# EasyEDA Pro project ProPrj_arm_can_tool_2026-04-18.epro, board PCB1
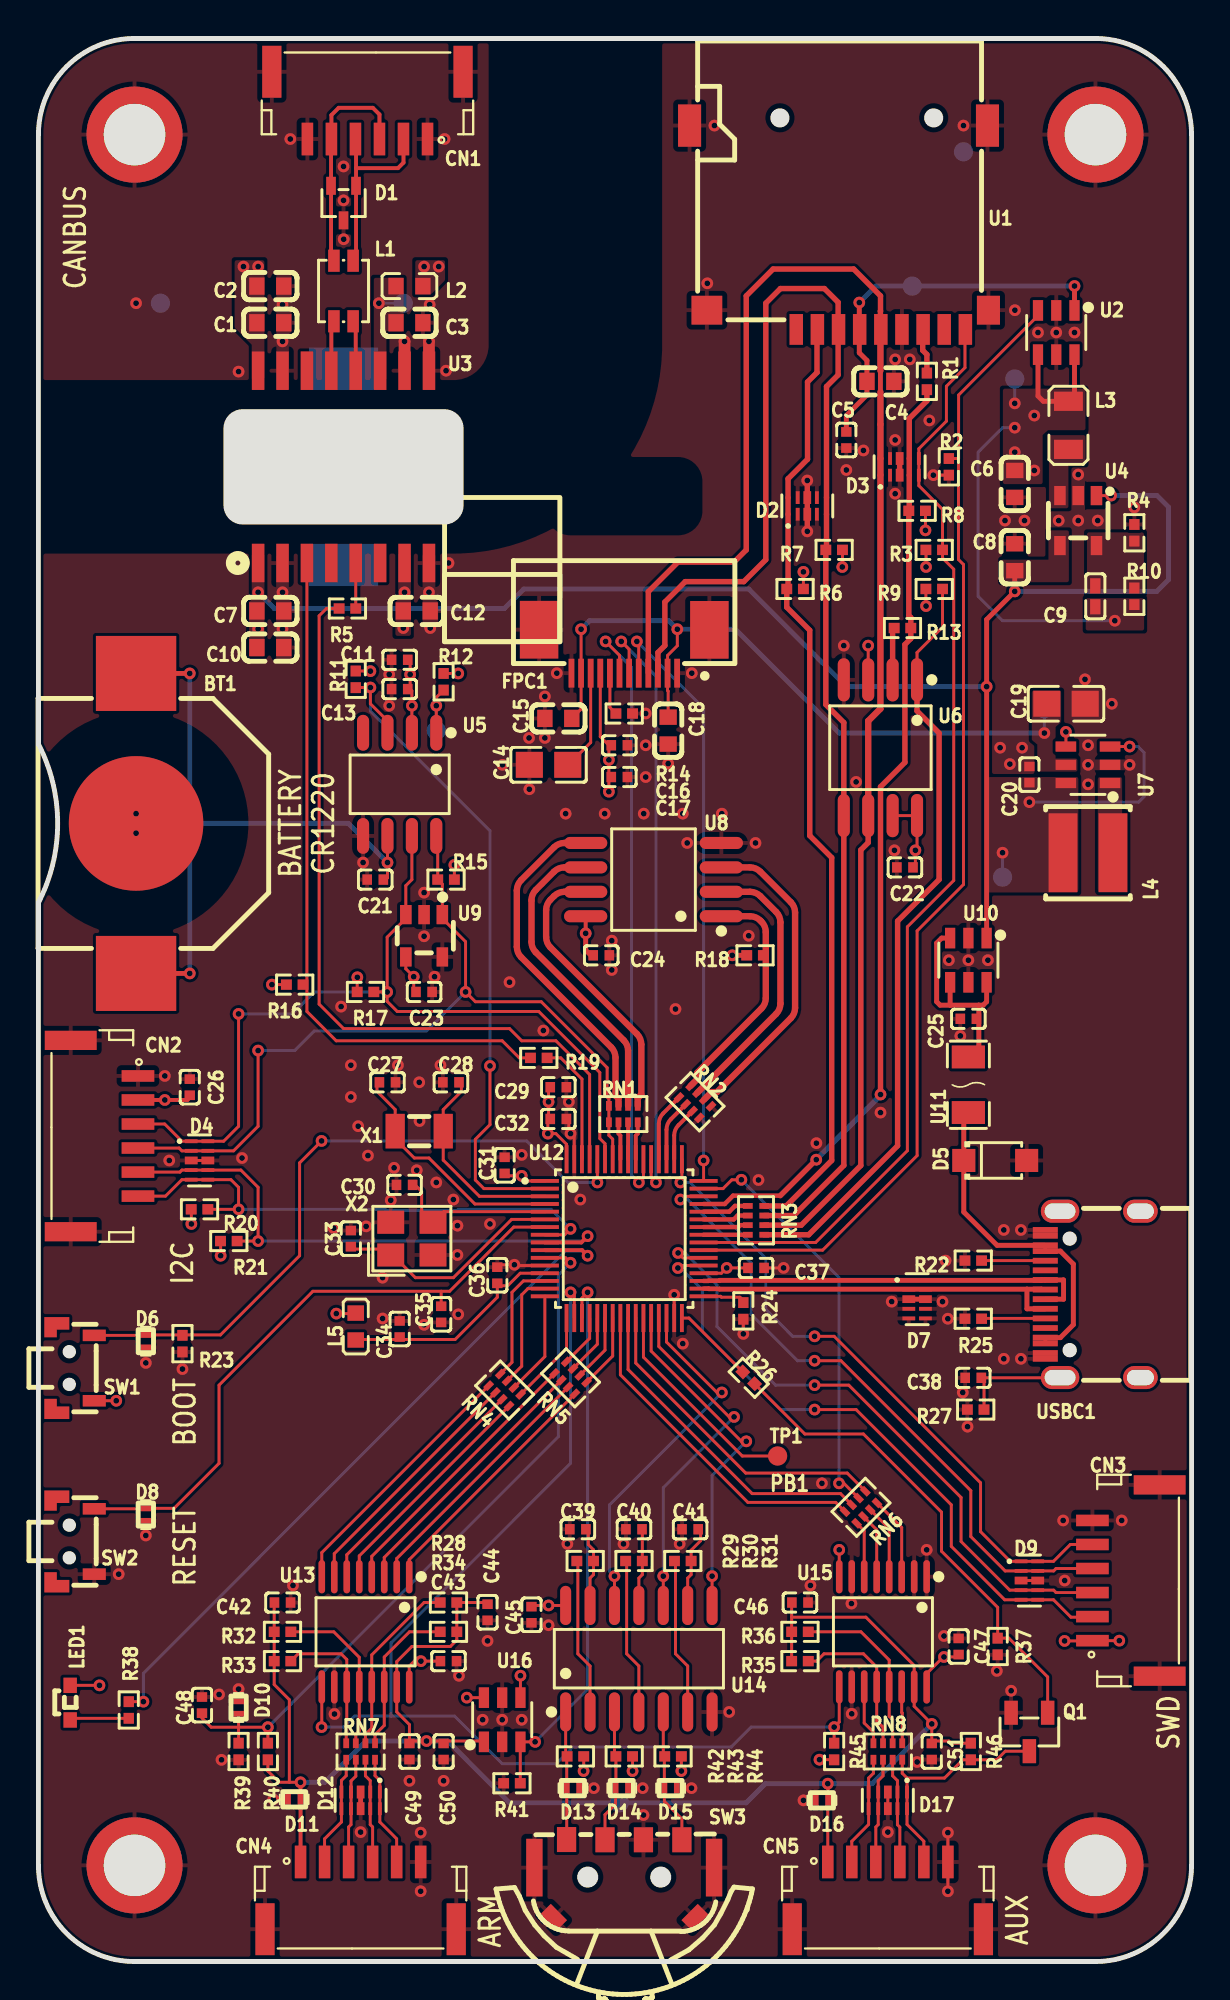
[diagram p3: board, top side]
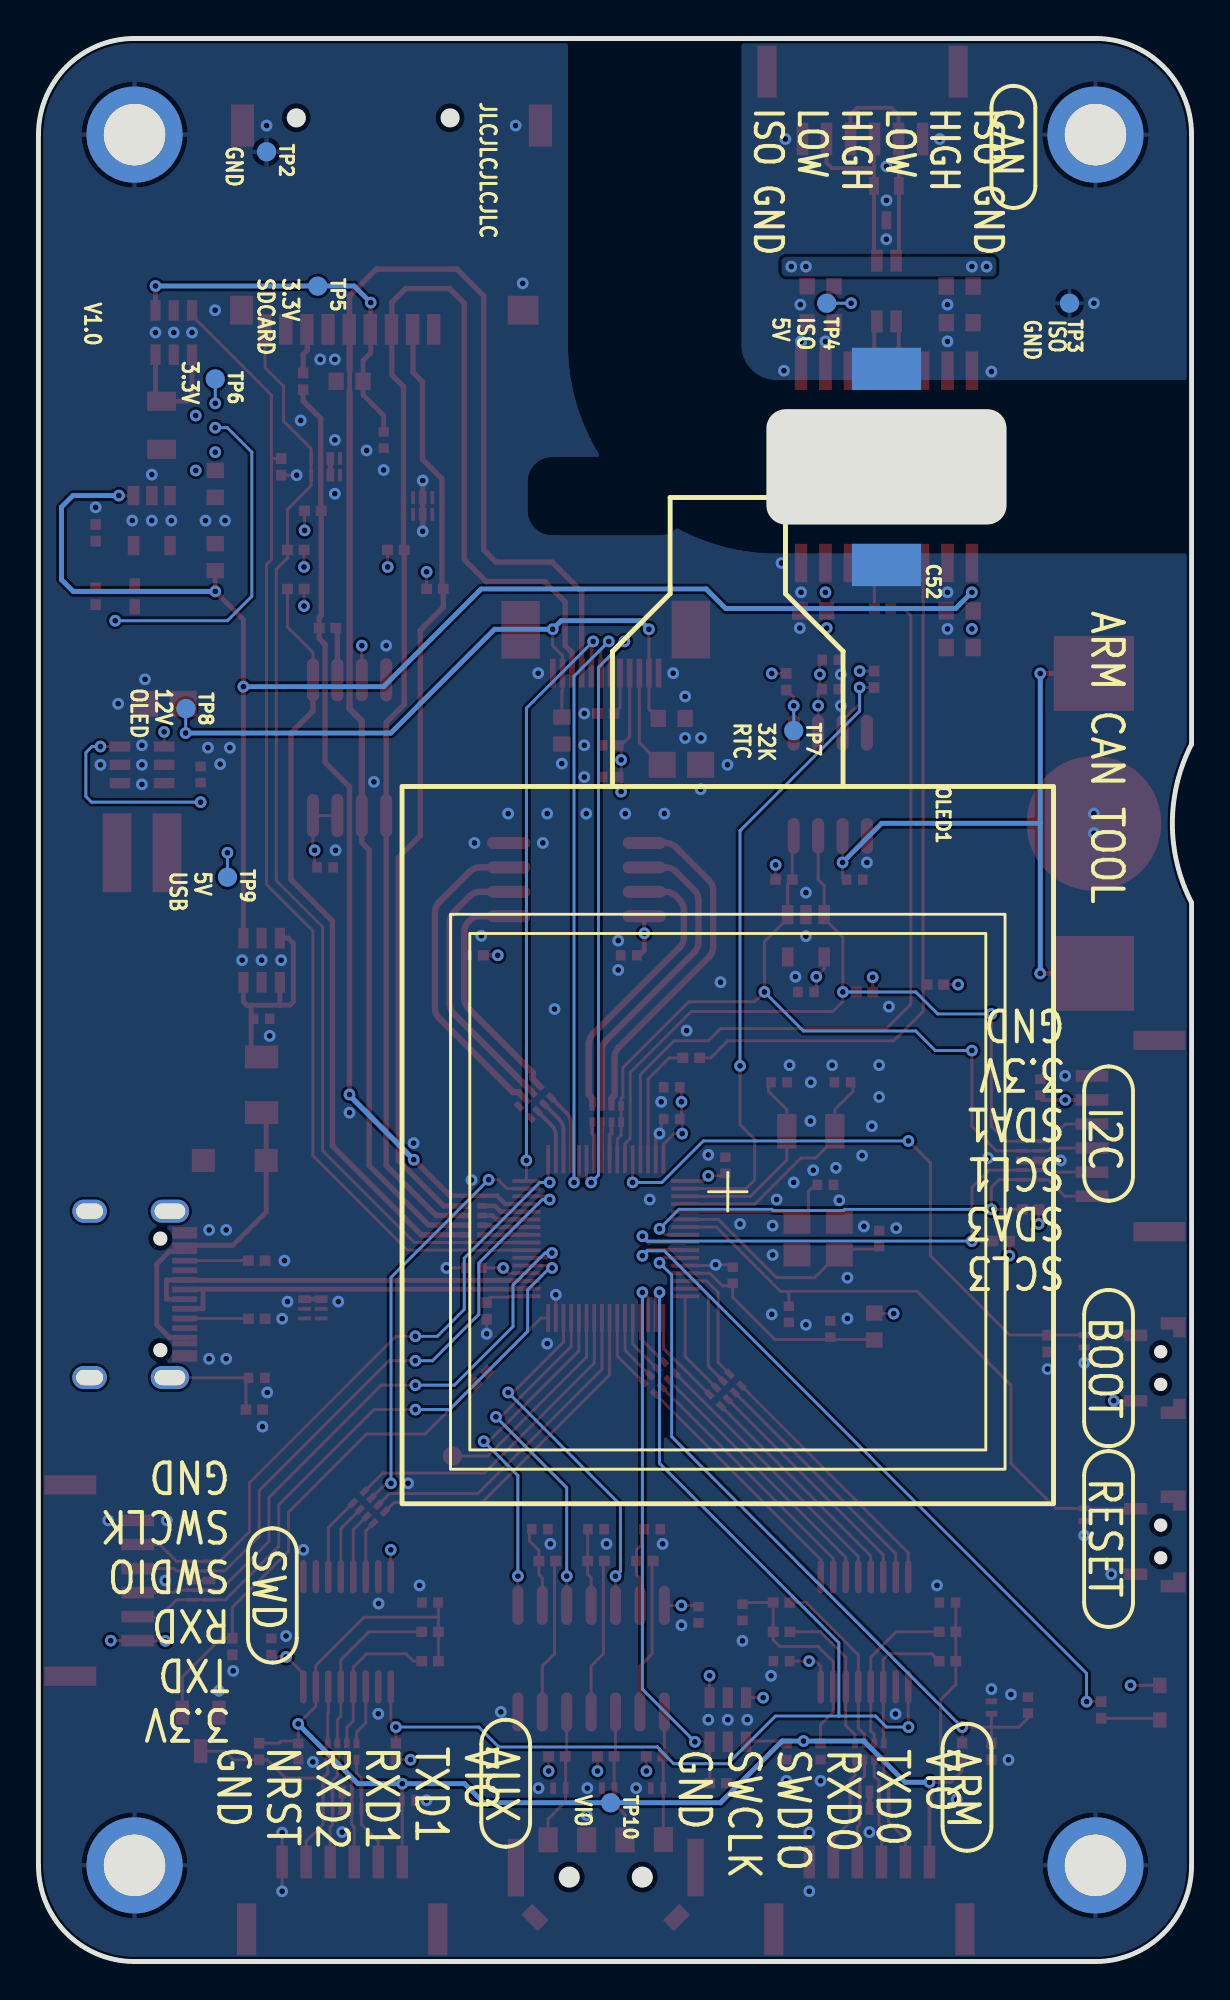
[diagram p4: board, bottom side, seen from below]

Outline 60 x 100 mm; copper layers: Top Layer, Inner1, Inner2, Bottom Layer. Coordinates in mm from the lower left corner of the outline.
Outline path: 0,95 arc(1.46,98.54) 5,100 55,100 arc(58.54,98.54) 60,95 60,5 arc(58.54,1.46) 55,0 5,0 arc(1.46,1.46) 0,5 0,55.06 arc(1,59.18) 0,63.3 0,95
Stack: Top Layer 0.035mm 外层铜厚1oz / Dielectric1 0.2104mm 7628 RC49% 8.6mil / Inner1 0.0152mm 内层铜厚 / Dielectric2 1.065mm 1.1mm H/HOZ 含铜 / Inner2 0.0152mm 内层铜厚 / Dielectric3 0.2104mm 7628 RC49% 8.6mil / Bottom Layer 0.035mm 外层铜厚1oz

## Design rules (mm)
net HS_DP: DP1
net HS_DM: DP1
template: Custom Config
spacing copperThickness1oz (default): track to track 0.102, other pairs 0.152 to 0.3
spacing copperThickness2oz: track to track 0.203, other pairs 0.152 to 0.3
track width copperThickness1oz (default): min 0.127, default 0.254, max 2.54
track width copperThickness2oz: min 0.203, default 0.254, max 2.54
track width power: min 0.152, default 0.203, max 2.54
differential pair differentialPair (default): width min 0.127, default 0.254, max 2.54; gap min 0.152, default 0.203
via viaSize (default): diameter min 0.5, default 0.61, max 10; hole min 0.3, default 0.305, max 6.299
['net', 'can gnd'] ['NET', '3.3V'] uses copper_CAN_GND
['net', 'can gnd'] ['NET', 'GND'] uses copper_CAN_GND
pour e771 uses copper_direct
pour e16 uses copper_direct
pour e42 uses copper_direct
pour e439 uses copper_direct
pour e204 uses copper_direct
pour e2702 uses copper_direct
pour e3149 uses copper_direct
pour e8360 uses copper_direct
pour e1013 uses copper_direct
pour e2974 uses copper_direct
pour e4745 uses copper_direct
pour e7080 uses copper_direct
pour e9255 uses copper_direct
pour e10368 uses copper_direct
pour e11440 uses copper_direct
pour e15142 uses copper_direct
pour e9206 uses copper_direct
pour e146 uses copper_direct
pour e158 uses copper_direct

## Placement (name value [footprint] x y rotation side)
BT1  MY-1220-03  [BAT-SMD_MY-1220-03]  5.08 59.18 90 top
C1  100nF  [C0603]  12.06 85.22 180 top
C2  10uF  [C0603]  12.06 87.12 180 top
C3  1uF  [C0603]  19.3 85.22 180 top
C4  4.7uF  [C0603]  43.81 82.17 180 top
C5  100nF  [C0402#2]  42.04 79.12 270 top
C6  22uF  [C0603]  50.8 76.83 90 top
C7  100nF  [C0603]  12.06 70.23 180 top
C8  4.7uF  [C0603]  50.8 73.02 270 top
C9  22pF  [C0402]  54.99 70.99 270 top
C10  10uF  [C0603]  12.06 68.33 180 top
C11  1uF  [C0402#2]  18.8 67.69 0 top
C12  1uF  [C0603]  19.69 70.23 180 top
C13  100nF  [C0402#2]  18.8 66.17 0 top
C14  2.2uF  [C0805]  26.54 62.23 0 top
C15  100nF  [C0603]  27.05 64.64 0 top
C16  100nF  [C0402#2]  30.23 63.25 180 top
C17  4.7uF  [C0402#2]  30.23 61.59 180 top
C18  100nF  [C0603]  32.77 64.01 90 top
C19  10uF  [C0805]  53.47 65.4 180 top
C20  4.7uF  [C0402#2]  51.56 61.72 270 top
C21  1uF  [C0402#2]  17.53 56.26 0 top
C22  100nF  [C0402#2]  45.09 56.9 180 top
C23  100nF  [C0402#2]  20.07 50.42 180 top
C24  100nF  [C0402#2]  29.29 52.32 0 top
C25  1uF  [C0402#2]  48.39 49.02 0 top
C26  1uF  [C0402#2]  7.87 45.47 270 top
C27  18pF  [C0402#2]  18.16 45.72 180 top
C28  18pF  [C0402#2]  21.46 45.72 0 top
C29  4.7uF  [C0402#2]  27.05 45.47 180 top
C30  15pF  [C0402#2]  19.05 40.39 180 top
C31  100nF  [C0402#2]  24.26 41.4 270 top
C32  100nF  [C0402#2]  27.05 43.81 180 top
C33  15pF  [C0402#2]  16.26 37.59 270 top
C34  1uF  [C0402#2]  18.8 32.89 270 top
C35  100nF  [C0402#2]  20.96 33.65 90 top
C36  100nF  [C0402#2]  23.88 35.69 270 top
C37  100nF  [C0402#2]  37.34 36.07 180 top
C38  4.7nF  [C0402#2]  48.64 30.35 0 top
C39  1uF  [C0402#2]  28.07 22.48 180 top
C40  1uF  [C0402#2]  30.99 22.48 180 top
C41  1uF  [C0402#2]  33.91 22.48 180 top
C42  100nF  [C0402#2]  12.7 18.67 0 top
C43  100nF  [C0402#2]  21.34 15.62 0 top
C44  100nF  [C0402#2]  23.37 18.16 270 top
C45  100nF  [C0402#2]  25.65 18.03 90 top
C46  100nF  [C0402#2]  39.62 18.67 0 top
C47  100nF  [C0402#2]  47.88 16.38 90 top
C48  100nF  [C0402#2]  8.51 13.33 90 top
C49  1uF  [C0402#2]  19.3 10.92 90 top
C50  100nF  [C0402#2]  21.08 10.92 270 top
C51  100nF  [C0402#2]  46.48 10.92 270 top
C52  2.2nF  [CAP-SMD_L7.8-W5.4-P9.60_TMY1222M]  15.88 77.72 90 bottom
CN1  SM06B-GHS-TB(LF)(SN)  [CONN-TH_SM06B-GHS-TB-LF-SN]  17.12 96.52 180 top
CN2  SM06B-GHS-TB(LF)(SN)  [CONN-TH_SM06B-GHS-TB-LF-SN]  3.43 42.93 270 top
CN3  SM06B-GHS-TB(LF)(SN)  [CONN-TH_SM06B-GHS-TB-LF-SN]  56.59 19.81 90 top
CN4  SM06B-GHS-TB(LF)(SN)  [CONN-TH_SM06B-GHS-TB-LF-SN]  16.76 3.43 0 top
CN5  SM06B-GHS-TB(LF)(SN)  [CONN-TH_SM06B-GHS-TB-LF-SN]  44.2 3.43 0 top
D1  ESDCAN03-2BWY  [SOT-323-3_L2.0-W1.3-P1.30-LS2.1-BR]  15.88 91.44 90 top
D2  H5VU25U  [DFN2510-10_L2.5-W1.0-P0.50-BL]  40 75.69 0 top
D3  H5VU25U  [DFN2510-10_L2.5-W1.0-P0.50-BL]  44.81 77.72 0 top
D4  H5VU25U  [DFN2510-10_L2.5-W1.0-P0.50-BL]  8.38 41.66 270 top
D5  SMF5.0A  [SOD-123FL_L2.7-W1.8-LS3.8-RD]  49.78 41.66 0 top
D6  H5VL10B  [SOD-882_L1.0-W0.6-BI]  5.59 32.26 90 top
D7  H5VU25U  [DFN2510-10_L2.5-W1.0-P0.50-BL]  45.72 34.44 270 top
D8  H5VL10B  [SOD-882_L1.0-W0.6-BI]  5.59 23.24 90 top
D9  H5VU25U  [DFN2510-10_L2.5-W1.0-P0.50-BL]  51.56 19.81 270 top
D10  H5VL10B  [SOD-882_L1.0-W0.6-BI]  10.41 13.21 270 top
D11  H5VL10B  [SOD-882_L1.0-W0.6-BI]  13.31 8.43 0 top
D12  H5VU25U  [DFN2510-10_L2.5-W1.0-P0.50-BL]  16.76 8.38 180 top
D13  H5VL10B  [SOD-882_L1.0-W0.6-BI]  27.81 9.02 180 top
D14  H5VL10B  [SOD-882_L1.0-W0.6-BI]  30.35 9.02 180 top
D15  H5VL10B  [SOD-882_L1.0-W0.6-BI]  32.89 9.02 180 top
D16  H5VL10B  [SOD-882_L1.0-W0.6-BI]  40.77 8.38 0 top
D17  H5VU25U  [DFN2510-10_L2.5-W1.0-P0.50-BL]  44.2 8.38 180 top
FPC1  AFC07-S12ECA-00  [FPC-SMD_12P-P0.50_AFC07-S12ECA-00]  30.48 68.12 180 top
L1  ACT1210-510-2P-TL00  [FILTER-SMD_4P-L3.2-W2.5-BL_ACT1210]  15.88 86.87 0 top
L2  GZ1608D601TF  [L0603]  19.3 87.12 180 top
L3  1uH  [IND-SMD_L2.5-W2.0-A]  53.59 79.88 90 top
L4  10uH  [IND-SMD_L4.1-W4.1_FTC404020S]  54.61 57.66 0 top
L5  10uH  [L0603]  16.51 33.02 270 top
LED1  LTST-S270KGKT  [LED-SMD_L1.7-W0.6-RD]  1.65 13.46 90 top
M1  Mech_Hole_3.2mm  [MECH_HOLE_3.2MM]  5 95 0 top
M2  Mech_Hole_3.2mm  [MECH_HOLE_3.2MM]  55 95 0 top
M3  Mech_Hole_3.2mm  [MECH_HOLE_3.2MM]  5 5 0 top
M4  Mech_Hole_3.2mm  [MECH_HOLE_3.2MM]  55 5 0 top
OLED1  ZJY150-2828KSWKG03  [OLED-ZJY150-2828KSWKG03]  30.48 40.03 0 bottom
Q1  AO3400A  [SOT-23-3_L2.9-W1.3-P1.90-LS2.4-BR]  51.56 11.94 90 top
R1  33Ω  [R0402]  46.23 82.17 90 top
R2  47kΩ  [R0402]  47.37 77.72 90 top
R3  47kΩ  [R0402]  46.61 73.41 180 top
R4  33kΩ  [R0402]  57.02 74.29 270 top
R5  33Ω  [R0402]  16.08 70.36 0 top
R6  47kΩ  [R0402]  39.37 71.37 0 top
R7  47kΩ  [R0402]  41.4 73.41 0 top
R8  47kΩ  [R0402]  45.72 75.44 0 top
R9  10kΩ  [R0402]  46.61 71.37 0 top
R10  150kΩ  [R0402]  57.02 70.99 270 top
R11  10kΩ  [R0402]  16.51 66.67 90 top
R12  10kΩ  [R0402]  21.08 66.55 90 top
R13  33Ω  [R0402]  44.96 69.34 180 top
R14  910kΩ  [R0402]  30.48 64.9 180 top
R15  4.7kΩ  [R0402]  21.21 56.26 180 top
R16  10kΩ  [R0402]  13.34 50.8 180 top
R17  4.7kΩ  [R0402]  17.02 50.42 0 top
R18  10kΩ  [R0402]  37.29 52.32 0 top
R19  33Ω  [R0402]  26.03 46.99 180 top
R20  4.7kΩ  [R0402]  8.38 39.12 0 top
R21  4.7kΩ  [R0402]  9.91 37.46 0 top
R22  5.1kΩ  [R0402]  48.64 36.45 180 top
R23  10kΩ  [R0402]  7.49 32.13 270 top
R24  12kΩ  [R0402]  36.68 33.83 270 top
R25  5.1kΩ  [R0402]  48.64 33.43 0 top
R26  33Ω  [R0402]  36.96 30.35 315 top
R27  1MΩ  [R0402]  48.77 28.7 0 top
R28  100kΩ  [R0402]  21.34 18.67 0 top
R29  22kΩ  [R0402]  28.45 20.83 0 top
R30  22kΩ  [R0402]  30.99 20.83 0 top
R31  22kΩ  [R0402]  33.53 20.83 0 top
R32  100kΩ  [R0402]  12.7 17.14 180 top
R33  100kΩ  [R0402]  12.7 15.62 180 top
R34  100kΩ  [R0402]  21.34 17.14 0 top
R35  100kΩ  [R0402]  39.62 15.62 180 top
R36  100kΩ  [R0402]  39.62 17.14 180 top
R37  100kΩ  [R0402]  49.91 16.38 90 top
R38  150Ω  [R0402]  4.7 13.08 270 top
R39  10kΩ  [R0402]  10.41 10.92 90 top
R40  4.7kΩ  [R0402]  11.94 10.92 270 top
R41  47kΩ  [R0402]  24.64 9.27 0 top
R42  10kΩ  [R0402]  27.94 10.67 0 top
R43  10kΩ  [R0402]  30.48 10.67 0 top
R44  10kΩ  [R0402]  33.02 10.67 0 top
R45  10kΩ  [R0402]  41.4 10.92 270 top
R46  10kΩ  [R0402]  48.51 10.92 270 top
RN1  33Ω  [RES-ARRAY-SMD_0402-8P-L2.0-W1.0-BL]  30.43 44.07 0 top
RN2  33Ω  [RES-ARRAY-SMD_0402-8P-L2.0-W1.0-BL]  34.16 44.7 135 top
RN3  33Ω  [RES-ARRAY-SMD_0402-8P-L2.0-W1.0-BL]  37.34 38.54 90 top
RN4  33Ω  [RES-ARRAY-SMD_0402-8P-L2.0-W1.0-BL]  24.26 29.72 315 top
RN5  33Ω  [RES-ARRAY-SMD_0402-8P-L2.0-W1.0-BL]  27.69 30.35 315 top
RN6  33Ω  [RES-ARRAY-SMD_0402-8P-L2.0-W1.0-BL]  42.8 23.62 225 top
RN7  33Ω  [RES-ARRAY-SMD_0402-8P-L2.0-W1.0-BL]  16.76 10.92 0 top
RN8  33Ω  [RES-ARRAY-SMD_0402-8P-L2.0-W1.0-BL]  44.2 10.92 0 top
SW1  TS24CA  [SW-SMD_TS24CA]  1.93 30.86 90 top
SW2  TS24CA  [SW-SMD_TS24CA]  1.93 21.84 90 top
SW3  SLLB510100  [SW-SMD_SLLB510100]  30.48 4.32 180 top
TP1  -  [TEST PAD]  38.46 26.29 0 top
TP2  -  [TEST PAD]  48.13 94.11 270 bottom
TP3  -  [TEST PAD]  6.35 86.23 270 bottom
TP4  -  [TEST PAD]  18.98 86.23 270 bottom
TP5  -  [TEST PAD]  45.47 87.12 270 bottom
TP6  -  [TEST PAD]  50.8 82.29 270 bottom
TP7  -  [TEST PAD]  20.7 64.01 270 bottom
TP8  -  [TEST PAD]  52.32 65.15 270 bottom
TP9  -  [TEST PAD]  50.16 56.39 270 bottom
TP10  -  [TEST PAD]  30.23 8.25 270 bottom
U1  TF-115Y-ACP9  [SIM-SMD_TF-115Y-BCP9]  41.66 90.17 180 top
U2  TPS22929DDBVR  [SOT-23-6_L2.9-W1.6-P0.95-LS2.8-BL]  52.96 84.71 180 top
U3  CA-IS2062VW  [CA-IS305XW]  15.88 77.72 0 top
U4  TLV62569DBVR  [SOT-23-5_L3.0-W1.7-P0.95-LS2.8-BR]  54.1 74.93 90 top
U5  SD8931  [SOP-8_L4.9-W3.9-P1.27-LS6.0-BL-1]  18.8 61.21 180 top
U6  W25Q128JVSIQ  [SOIC-8_L5.3-W5.3-P1.27-LS8.0-BL]  43.81 63.12 180 top
U7  TLV61046ADBVR  [SOT-23-6_L2.9-W1.6-P0.95-LS2.8-BL]  54.61 62.23 90 top
U8  W25Q128JVSIQ  [SOIC-8_L5.3-W5.3-P1.27-LS8.0-BL]  32 56.26 90 top
U9  24C64S(XBLW)  [SOT-23-5_L2.9-W1.6-P0.95-LS2.8-BR]  20.07 53.34 90 top
U10  TPS22929DDBVR  [SOT-23-6_L2.9-W1.6-P0.95-LS2.8-BL]  48.39 52.07 180 top
U11  1206L050YR  [F1206]  48.39 45.59 90 top
U12  AT32F405RCT7-7  [LQFP-64_L7.0-W7.0-P0.40-LS9.0-TL]  30.48 37.59 0 top
U13  SN74AVC4T774PWR  [TSSOP-16_L5.0-W4.4-P0.65-LS6.4-BL]  17.02 17.14 180 top
U14  74HC14D,653  [SOIC-14_L8.7-W3.9-P1.27-LS6.0-BL]  31.24 15.75 0 top
U15  SN74AVC4T774PWR  [TSSOP-16_L5.0-W4.4-P0.65-LS6.4-BL]  43.94 17.14 180 top
U16  TPS22929DDBVR  [SOT-23-6_L2.9-W1.6-P0.95-LS2.8-BL]  24.13 12.57 0 top
USBC1  TYPE-C-31-M-12  [USB-C_SMD-TYPE-C-31-M-12]  54.86 34.69 90 top
X1  32.768kHz  [FC-135R_L3.2-W1.5]  19.81 43.18 180 top
X2  12MHz  [CRYSTAL-SMD_4P-L3.2-W2.5-BL]  19.43 37.59 0 top

## Footprints (pads in the part's own frame, mm; a bottom-side part is the same pattern mirrored in y, then rotated)
BAT-SMD_MY-1220-03
  rect 3.9x4.18 smd: 1(-7.8,0) 2(7.8,0)
  round 7 smd: 3(0,0)
C0402
  rect 0.79x0.54 smd: 1(-0.545,0) 2(0.545,0)
C0402#2
  rect 0.5x0.54 smd: 1(-0.42,0) 2(0.42,0)
C0603
  rect 0.8x0.9 smd: 1(-0.7,0) 2(0.7,0)
C0805
  rect 1.41x1.35 smd: 1(-1,0) 2(1,0)
CA-IS305XW
  rect 0.65x2 smd: 1(-4.445,-5) 2(-3.175,-5) 3(-1.905,-5) 4(-0.635,-5) 5(0.635,-5) 6(1.905,-5) 7(3.175,-5) 8(4.445,-5) 9(4.445,5) 10(3.175,5) 11(1.905,5) 12(0.635,5) 13(-0.635,5) 14(-1.905,5) 15(-3.175,5) 16(-4.445,5)
CAP-SMD_L7.8-W5.4-P9.60_TMY1222M
  rect 2.2x3.6 smd: 1(-5.1,0) 2(5.1,0)
CONN-TH_SM06B-GHS-TB-LF-SN
  rect 0.6x1.7 smd: 1(-3.126,1.75) 2(-1.875,1.75) 3(-0.625,1.75) 4(0.625,1.75) 5(1.875,1.75) 6(3.124,1.75)
  rect 1x2.7 smd: 7(-4.974,-1.749) 8(4.974,-1.75)
CRYSTAL-SMD_4P-L3.2-W2.5-BL
  rect 1.4x1.2 smd: 1(-1.1,-0.85) 2(1.1,-0.85) 3(1.1,0.85) 4(-1.1,0.85)
DFN2510-10_L2.5-W1.0-P0.50-BL
  rect 0.2x0.665 smd: 1(-1,-0.433) 2(-0.5,-0.433) 4(0.5,-0.433) 5(1,-0.433) 6(1,0.433) 7(0.5,0.433) 9(-0.5,0.433) 10(-1,0.433)
  rect 0.4x0.665 smd: 3(0,-0.433) 8(0,0.433)
F1206
  rect 1.19x1.728 smd: 1(-1.445,0) 2(1.445,0)
FC-135R_L3.2-W1.5
  rect 1x1.8 smd: 1(-1.25,0) 2(1.25,0)
FILTER-SMD_4P-L3.2-W2.5-BL_ACT1210
  rect 0.6x1.15 smd: 1(-0.5,-1.575) 2(0.5,-1.575) 3(0.5,1.575) 4(-0.5,1.575)
FPC-SMD_12P-P0.50_AFC07-S12ECA-00
  rect 0.3x1.5 smd: 1(-2.754,1.13) 2(-2.255,1.13) 3(-1.754,1.13) 4(-1.254,1.13) 5(-0.754,1.13) 6(-0.255,1.13) 7(0.245,1.13) 8(0.746,1.13) 9(1.246,1.13) 10(1.746,1.13) 11(2.245,1.13) 12(2.745,1.13)
  rect 2x3 smd: 13(4.43,-1.13) 14(-4.43,-1.124)
IND-SMD_L2.5-W2.0-A
  rect 1x1.5 smd: 1(-1.25,0) 2(1.25,0)
IND-SMD_L4.1-W4.1_FTC404020S
  rect 1.5x4.1 smd: 1(-1.3,0) 2(1.3,0)
L0603
  rect 0.8x0.864 smd: 1(-0.7,0) 2(0.7,0)
LED-SMD_L1.7-W0.6-RD
  rect 0.8x0.7 smd: 1(-0.9,0) 2(0.9,0)
LQFP-64_L7.0-W7.0-P0.40-LS9.0-TL
  rect 1.46x0.2 smd: 1(-4.13,3) 2(-4.13,2.6) 3(-4.13,2.2) 4(-4.13,1.8) 5(-4.13,1.4) 6(-4.13,1) 7(-4.13,0.6) 8(-4.13,0.2) 9(-4.13,-0.2) 10(-4.13,-0.6) 11(-4.13,-1) 12(-4.13,-1.4) 13(-4.13,-1.8) 14(-4.13,-2.2) 15(-4.13,-2.6) 16(-4.13,-3) 33(4.13,-3) 34(4.13,-2.6) 35(4.13,-2.2) 36(4.13,-1.8) 37(4.13,-1.4) 38(4.13,-1) 39(4.13,-0.6) 40(4.13,-0.2) 41(4.13,0.2) 42(4.13,0.6) 43(4.13,1) 44(4.13,1.4) 45(4.13,1.8) 46(4.13,2.2) 47(4.13,2.6) 48(4.13,3)
  rect 0.2x1.46 smd: 17(-3,-4.13) 18(-2.6,-4.13) 19(-2.2,-4.13) 20(-1.8,-4.13) 21(-1.4,-4.13) 22(-1,-4.13) 23(-0.6,-4.13) 24(-0.2,-4.13) 25(0.2,-4.13) 26(0.6,-4.13) 27(1,-4.13) 28(1.4,-4.13) 29(1.8,-4.13) 30(2.2,-4.13) 31(2.6,-4.13) 32(3,-4.13) 49(3,4.13) 50(2.6,4.13) 51(2.2,4.13) 52(1.8,4.13) 53(1.4,4.13) 54(1,4.13) 55(0.6,4.13) 56(0.2,4.13) 57(-0.2,4.13) 58(-0.6,4.13) 59(-1,4.13) 60(-1.4,4.13) 61(-1.8,4.13) 62(-2.2,4.13) 63(-2.6,4.13) 64(-3,4.13)
MECH_HOLE_3.2MM
  round 5 hole 3.2: 1(0,0)
R0402
  rect 0.566x0.54 smd: 1(-0.433,0) 2(0.433,0)
RES-ARRAY-SMD_0402-8P-L2.0-W1.0-BL
  rect 0.3x0.505 smd: 1(-0.75,0.427) 2(-0.25,0.427) 3(0.25,0.427) 4(0.75,0.427) 5(0.75,-0.427) 6(0.25,-0.427) 7(-0.25,-0.427) 8(-0.75,-0.427)
SIM-SMD_TF-115Y-BCP9
  rect 0.7x1.6 smd: 1(2.225,5.3) 2(1.125,5.3) 3(0.025,5.3) 4(-1.075,5.3) 5(-2.175,5.3) 6(-3.275,5.3) 7(-4.375,5.3) 8(-5.475,5.3) Cd(-6.575,5.3)
  rect 1.2x1.5 smd: 10(-7.775,4.3)
  rect 1.6x1.5 smd: 11(6.875,4.3)
  rect 1.2x2.2 smd: 12(-7.725,-5.3) 13(7.775,-5.3)
SOD-123FL_L2.7-W1.8-LS3.8-RD
  rect 1.2x1.2 smd: 1(-1.635,0) 2(1.635,0)
SOD-882_L1.0-W0.6-BI
  rect 0.3x0.6 smd: 1(-0.325,0) 2(0.325,0)
SOIC-8_L5.3-W5.3-P1.27-LS8.0-BL
  oval 0.63x2.25 smd: 1(-1.905,-3.53) 2(-0.635,-3.53) 3(0.635,-3.53) 4(1.905,-3.53) 5(1.905,3.53) 6(0.635,3.53) 7(-0.635,3.53) 8(-1.905,3.53)
SOIC-14_L8.7-W3.9-P1.27-LS6.0-BL
  oval 0.574x2.038 smd: 1(-3.81,-2.769) 2(-2.54,-2.769) 3(-1.27,-2.769) 4(0,-2.769) 5(1.27,-2.769) 6(2.54,-2.769) 7(3.81,-2.769) 8(3.81,2.769) 9(2.54,2.769) 10(1.27,2.769) 11(0,2.769) 12(-1.27,2.769) 13(-2.54,2.769) 14(-3.81,2.769)
SOP-8_L4.9-W3.9-P1.27-LS6.0-BL-1
  oval 0.63x1.865 smd: 1(-1.905,-2.683) 2(-0.635,-2.683) 3(0.635,-2.683) 4(1.905,-2.683) 5(1.905,2.683) 6(0.635,2.683) 7(-0.635,2.683) 8(-1.905,2.683)
SOT-23-3_L2.9-W1.3-P1.90-LS2.4-BR
  rect 1.25x0.7 smd: 1(1,-0.95) 2(1,0.95) 3(-1,0)
SOT-23-5_L2.9-W1.6-P0.95-LS2.8-BR
  rect 1x0.6 smd: 1(1.1,-0.95) 2(1.1,0) 3(1.1,0.95) 4(-1.1,0.95) 5(-1.1,-0.95)
SOT-23-5_L3.0-W1.7-P0.95-LS2.8-BR
  rect 1x0.6 smd: 1(1.3,-0.95) 2(1.3,0) 3(1.3,0.95) 4(-1.3,0.95) 5(-1.3,-0.95)
SOT-23-6_L2.9-W1.6-P0.95-LS2.8-BL
  rect 0.532x1.072 smd: 1(-0.95,-1.149) 2(0,-1.149) 3(0.95,-1.149) 4(0.95,1.149) 5(0,1.149) 6(-0.95,1.149)
SOT-323-3_L2.0-W1.3-P1.30-LS2.1-BR
  rect 0.936x0.5 smd: 1(0.898,-0.65) 2(0.898,0.65) 3(-0.898,0)
SW-SMD_SLLB510100
  rect 1.001x1.3 smd: 1(-3,-2.013) 2(3,-2.026) C(-1,-2.013) T(1,-2.013)
  rect 0.851x2.999 smd: 4(-4.675,-0.566) 5(4.675,-0.566)
  rect 0.8x1.199 smd rot 135: 6(-3.683,2.026)
  rect 0.8x1.199 smd rot 45: 7(3.683,2.026)
SW-SMD_TS24CA
  custom 1.05x1.3 smd: 1(-2.125,0.975) 2(2.125,0.975)
  rect 0.6x1.2 smd: 3(-1.7,-0.975) 4(1.7,-0.975)
TEST PAD
  round 1 smd: 1(0,0)
TSSOP-16_L5.0-W4.4-P0.65-LS6.4-BL
  oval 0.343x1.732 smd: 1(-2.275,-2.866) 2(-1.625,-2.866) 3(-0.975,-2.866) 4(-0.325,-2.866) 5(0.325,-2.866) 6(0.975,-2.866) 7(1.625,-2.866) 8(2.275,-2.866) 9(2.275,2.866) 10(1.625,2.866) 11(0.975,2.866) 12(0.325,2.866) 13(-0.325,2.866) 14(-0.975,2.866) 15(-1.625,2.866) 16(-2.275,2.866)
USB-C_SMD-TYPE-C-31-M-12
  oval 1.2x2 hole 0.8x1.6: 0(-4.325,1.706) 1(4.325,1.706)
  oval 1.2x1.8 hole 0.8x1.4: 2(4.325,-2.474) 3(-4.325,-2.474)
  rect 0.3x1.3 smd: A1(-3.35,2.474) A4(-2.55,2.474) A5(-1.25,2.474) A6(-0.25,2.474) A7(0.25,2.474) A8(1.25,2.474) A9(2.55,2.474) A12(3.35,2.474) B1(3.05,2.474) B4(2.25,2.474) B5(1.75,2.474) B6(0.75,2.474) B7(-0.75,2.474) B8(-1.75,2.474) B9(-2.25,2.474) B12(-3.05,2.474)

## Nets
As in the schematic.

Pads without a net: SW1 1 2; SW2 1 2; U1 1 8; U3 4 6 14; U5 4; USBC1 1 2 3 A8 B8

## Via types
v1: diameter 0.61, hole 0.305, Top Layer to Bottom Layer, 304 vias

## Routing (per net, layer and track width the routed paths; a pad name or vN(x,y) marks a point on that pad's centre or on a via; arc(x,y) is an arc through that point)
3.3V: length 88.7
  Top Layer w0.152: v1(56.24,16.69) CN3.1 54.83,16.67 v1(53.39,16.67) ; v1(12.15,50.8) R16.2 ; R17.1 16.59,51.17 v1(16.59,51.18) ; L5.1 16.48,33.69 v1(15.5,33.69) ; U6.7 U6.8 45.72,57.87 v1(45.63,57.78) 45.63,56.9 ; v1(7.96,38.35) 7.96,39.11 R20.1 ; 26.51,45.47 26.54,45.43 v1(26.54,44.7) 26.54,43.85 26.51,43.81 v1(26.51,43.05) 26.92,43.05 27.48,42.5 U12.64 ; R43.2 v1(30.91,9.91) ; v1(46.18,70.48) 46.18,70.49 R9.1 ; v1(29.68,60.83) v1(29.68,62.49) 29.68,63.25 29.23,63.69 FPC1.9 ; 19.43,63.9 v1(19.43,65.3) 19.43,66.08 19.34,66.17 v1(19.34,66.93) 19.34,67.69 ; SW1.3 v1(4.05,29.16) ; v1(43.18,68.43) U6.3 ; U12.36 35.54,35.79 v1(35.81,36.07) 36.79,36.07 ; v1(3.17,14.36) LED1.2 ; v1(17.27,67.1) 17.26,67.11 R11.2 ; R15.1 v1(21.64,57.02) ; v1(22.29,13.72) U16.6 ; R42.2 28.37,9.91 v1(28.37,9.91) ; v1(40.64,10.5) 41.39,10.5 R45.2 ; U14.14 25.72,18.52 25.65,18.58 ; R21.1 9.48,37.46 v1(9.48,36.7) ; v1(41.83,72.52) 41.84,72.52 41.84,73.41 ; 19.29,14.28 19.29,15.36 19.56,15.62 v1(19.9,15.62) 20.79,15.62 ; U12.1 25.41,40.59 v1(25.15,40.86) 24.26,40.86 ; R3.2 46.18,73.4 v1(46.18,72.52) ; R12.2 v1(21.84,66.98) ; U9.4 19.12,51.62 v1(19.53,51.21) 19.53,50.43 19.52,50.42 ; v1(39.8,72.26) R6.2 ; U15.8 v1(41.67,21.41) ; R8.2 v1(46.15,74.42) ; R44.2 v1(33.45,9.91) ; 47.88,15.84 v1(47.12,15.84) 47.08,15.84 46.22,14.97 46.22,14.28 ; v1(53.46,63.94) U7.4 ; v1(25.08,14.86) U16.4
  Top Layer w0.203: 7.87,44.92 7.75,44.8 v1(6.58,44.8) CN2.2 ; v1(28.47,53.47) U8.8
  Top Layer w0.254: U2.6 53.91,81.45 L3.2 52.28,81.13 52.01,81.41 U2.4 ; v1(28.47,53.47) 28.47,52.59 28.74,52.32 ; v1(36.1,52.32) R18.1
  Bottom Layer w0.152: v1(56.01,69.72) 50.16,69.72 48.9,70.99 48.9,78.49 50.17,79.76 v1(50.8,79.76) ; v1(50.8,81.03) TP6.1
  vias: v1(18.99,69.34) v1(19.05,71.2) v1(26.54,18.52) v1(50.8,78.49) v1(51.82,80.39) v1(51.82,77.53)
3.3V_ANA: length 11.6
  Top Layer w0.152: L5.2 16.54,32.35 21.68,32.35 23.88,34.54 23.88,35.14 24.42,35.14 25.07,35.79 U12.13
5V: length 88.1
  Top Layer w0.152: U7.3 v1(56.78,63.18) ; U4.1 v1(55.81,76.23)
  Top Layer w0.254: U10.1 v1(49.34,66.29) 49.34,69.78 v1(50.8,71.25) C8.2
  Bottom Layer w0.152: v1(51.56,60.29) 57.24,60.29 57.53,60.58 57.53,62.86 57.22,63.18 v1(56.78,63.18) ; v1(50.16,57.66) TP9.1
  Bottom Layer w0.254: v1(49.34,66.29) 42.04,66.29 36.96,71.37 25.26,71.37 24.24,70.36 12.27,70.36 v1(11.43,71.2) ; v1(50.8,71.25) 58.19,71.25 58.8,71.86 58.8,75.63 58.2,76.23 v1(55.81,76.23)
  vias: v1(11.43,69.29)
12V: length 37.6
  Top Layer w0.152: v1(28.23,69.28) FPC1.11 28.23,65.13 27.75,64.64 ; C18.2 32.77,66.06 32.73,66.09 FPC1.2 32.73,67.91 33.24,68.42 v1(33.24,69.28)
  Bottom Layer w0.152: TP8.1 52.34,65.13 v1(52.34,63.88)
  Bottom Layer w0.254: v1(28.23,69.28) 28.68,69.72 32.8,69.72 v1(33.24,69.28) 36.27,69.28 41.67,63.88 v1(52.34,63.88)
GND: length 37.9
  Top Layer w0.152: v1(47.32,6.7) CN5.6 v1(47.32,3.65) ; 51.13,19.81 D9.8 ; R24.2 v1(36.68,32.64) ; U12.12 24.81,36.19 v1(24.76,36.23) 23.88,36.23 ; D4.3 D4.8 ; 27.6,43.81 27.6,43.39 27.88,43.11 U12.63 ; 44.2,8.81 D17.8 ; 37.88,36.07 v1(38.77,36.07) ; U12.31 v1(33.08,34.67) ; v1(46.56,77.29) 47.37,77.29
  Top Layer w0.254: D12.8 16.76,8.81 ; D7.3 D7.8
  Top Layer w0.28: 44.81,77.29 D3.8 ; v1(40,74.37) D2.3 v1(40,77.01)
  Inner2 w0.762: 37.47,39.75 37.16,40.05 ; 37.47,39.75 v1(37.47,40.64) ; 37.47,39.75 41.66,35.56 41.66,26.08 ; 41.66,26.08 40.77,25.19 v1(40.77,24.87) ; 41.66,26.08 41.66,25.7
  vias: v1(4.18,20.14) v1(5.08,59.69) v1(5.08,58.67) v1(5.59,31.13) v1(5.59,22.15) v1(6.58,46.05) v1(6.81,41.66) v1(7.49,30.81) v1(9.4,13.89) v1(9.53,10.49) v1(10.41,14.17) v1(10.59,41.78) v1(12.22,8.43) v1(12.7,71.2) v1(12.7,69.29) v1(13.25,19.56) v1(15.37,38.14) v1(15.4,12.87) v1(15.75,49.66) v1(16.26,46.61) v1(16.26,44.96) v1(16.64,43.44) v1(16.76,6.73) v1(16.89,57.15) v1(17.15,41.91) v1(17.05,38.23) v1(17.91,35.56) v1(17.91,33.44) v1(18.25,66.93) v1(18.25,65.3) v1(18.33,39.58) v1(18.5,41.27) v1(18.71,46.61) v1(19.3,9.4) v1(19.69,41.15) v1(19.81,45.72) v1(19.83,43.71) v1(19.89,6.7) v1(19.89,3.65) v1(20.07,55.58) v1(20.07,53.31) v1(20.07,33.11) v1(20.32,71.2) v1(20.38,69.34) v1(20.61,51.21) v1(20.7,40.51) v1(20.92,46.61) v1(21.08,9.4) v1(21.34,72.72) v1(21.59,39.62) v1(21.8,38.27) v1(21.8,36.74) v1(21.84,33.65) v1(21.88,14.86) v1(23.11,12.57) v1(23.37,16.67) v1(23.5,38.35) v1(24.15,62.23) v1(24.13,12.57) v1(24.51,50.93) v1(25.15,41.95) v1(25.15,12.57) v1(25.53,63.63) v1(25.54,60.96) v1(26.27,48.41) v1(26.35,65.79) v1(26.35,63.63) v1(26.54,17.49) v1(26.97,66.99) v1(27.43,59.69) v1(27.52,21.72) v1(27.6,44.7) v1(27.69,43.05) v1(28.19,39.62) v1(28.9,9.02) v1(29.46,59.69) v1(29.83,53.09) v1(29.83,51.56) v1(30.44,21.72) v1(31.44,9.02) v1(31.5,59.69) v1(31.48,7.62) v1(31.6,64.9) v1(31.6,63.25) v1(31.6,61.59) v1(32.77,62.29) v1(33.15,49.53) v1(33.36,21.72) v1(33.53,59.69) v1(33.53,32.13) v1(33.76,58.17) v1(34,66.99) v1(33.98,9.02) v1(34.8,87.27) v1(35.17,95.47) v1(35.56,59.69) v1(35.94,12.98) v1(36.96,53.34) v1(37.31,58.17) v1(39.81,8.38) v1(40.17,19.56) v1(40.48,42.56) v1(41.91,68.43) v1(42.04,77.56) v1(42.3,18.61) v1(42.32,12.88) v1(42.54,61.34) v1(42.93,78.58) v1(43.81,44.14) v1(44.2,6.73) v1(44.4,34.32) v1(44.54,57.78) v1(44.58,83.31) v1(44.58,79.12) v1(44.58,76.33) v1(45.34,83.31) v1(45.72,10.38) v1(46.22,21.41) v1(46.35,80.14) v1(47.04,34.32) v1(47.12,16.93) v1(47.2,36.45) v1(47.32,33.43) v1(47.37,52.07) v1(47.97,48.13) v1(48.13,95.47) v1(48.1,29.59) v1(48.34,27.81) v1(48.39,52.07) v1(49.4,52.07) v1(49.87,15.11) v1(50.04,63.12) v1(50.23,38.04) v1(50.23,31.34) v1(50.29,74.93) v1(50.55,62.27) v1(50.61,14.08) v1(50.81,85.87) v1(51.12,38.04) v1(51.12,31.34) v1(51.18,63.12) v1(51.31,74.93) v1(52.01,84.71) v1(52.96,84.71) v1(53.09,74.93) v1(53.32,22.94) v1(53.4,19.81) v1(53.91,84.71) v1(54.1,77.32) v1(54.1,74.93) v1(54.45,66.67) v1(54.62,63.25) v1(54.62,62.23) v1(54.62,61.21) v1(55.12,74.93) v1(55.85,65.4) v1(56.37,22.94) v1(56.78,62.23) v1(57.02,75.62)
VBAT: length 34.6
  Top Layer w0.152: 18.07,56.26 18.16,56.35 U5.6
  Top Layer w0.254: BT1.1 v1(7.87,51.38) ; BT1.2 v1(7.87,66.98)
  Bottom Layer w0.254: 7.87,59.17 v1(7.87,51.38) ; 7.87,59.17 7.89,59.19 16.12,59.19 v1(18.16,57.15) ; 7.87,59.17 v1(7.87,66.98)
VBUS: length 11.7
  Top Layer w0.254: 48.92,49.73 47.44,49.73 ; 48.92,49.73 48.93,49.72 48.93,47.58 U11.2 ; 48.92,49.73 49.16,49.73 49.34,49.91 U10.6 ; 47.44,49.73 47.44,49.74 U10.4 ; 47.44,49.73 46.92,49.73 46.74,49.91 46.74,52.96 47,53.22 U10.3
ADC_VIO: length 38.2
  Top Layer w0.152: D10.2 10.41,12.19 ; 10.41,12.19 v1(11.94,12.19) R40.1 ; 10.41,12.19 8.99,12.19 8.51,12.66 8.51,12.79 ; 10.41,12.19 R39.2 ; U12.11 27.43,36.59 v1(27.69,36.34)
  Bottom Layer w0.152: v1(11.94,12.19) 11.94,12.19 27.05,27.29 27.05,35.7 v1(27.69,36.34)
AUX_RXD: length 17.2
  Top Layer w0.152: U12.25 30.68,30.79 37.13,24.33 41.73,24.33 RN6.6
AUX_SWO: length 21.4
  Top Layer w0.152: U12.47 35.62,40.19 36.08,40.65 v1(36.58,40.65) ; 42.67,24.1 41.91,24.87 v1(41.66,24.87)
  Bottom Layer w0.152: v1(41.66,24.87) 41.66,35.57 v1(36.58,40.65)
AUX_TXD: length 17.6
  Top Layer w0.152: U12.24 30.28,30.51 36.91,23.88 41.48,23.88 RN6.5
BOOT0: length 35.3
  Top Layer w0.152: v1(14.73,42.67) 13.59,41.53 13.59,36.7 9.47,32.58 D6.2 5.57,32.56 SW1.4 ; v1(29.08,40.51) 29.08,41.72 U12.60
  Bottom Layer w0.152: v1(14.73,42.67) 25.4,42.67 27.56,40.51 v1(29.08,40.51)
CAN_5V_IN: length 1.3
  Bottom Layer w0.152: v1(17.71,86.23) TP4.1
CAN_5V_OUT:
  vias: v1(10.67,88.14) v1(11.43,88.14) v1(20.07,88.14) v1(20.83,88.14)
CAN_GND: length 3
  Top Layer w0.61: U3.9 v1(20.32,84.25) ; U3.10 v1(19.05,84.25)
  vias: v1(5.08,86.23) v1(10.41,82.68) v1(12.7,86.16) v1(12.7,84.25) v1(13.11,94.77) v1(15.88,93.34) v1(15.88,91.58) v1(15.88,89.56) v1(20.36,86.16) v1(21.13,94.77) v1(21.21,82.72)
CAN_HI: length 11.7
  Top Layer w0.203: CN1.3 17.75,96.05 17.4,96.39 15.62,96.39 15.25,96.02 CN1.5 15.22,94.75 D1.2 15.22,88.59 L1.4
CAN_LO: length 10.2
  Top Layer w0.203: 19,94.77 19,93.54 18.71,93.26 16.53,93.26 ; L1.3 16.53,88.59 D1.1 16.53,93.26 ; 16.53,93.26 16.53,94.74 16.5,94.77
CAN_RX: length 41.2
  Top Layer w0.152: 15.44,70.36 14.99,70.36 14.6,69.98 14.6,49.78 15.88,48.51 24.51,48.51 25.15,47.88 26.92,47.88 28.68,46.12 U12.61
CAN_RX_INT: length 2.4
  Top Layer w0.152: U3.5 16.51,70.36
CAN_TX: length 36
  Top Layer w0.152: U3.3 13.97,49.4 15.49,47.88 24.13,47.88 25.02,46.99 R19.2
CONSOLE_RXD: length 32.9
  Top Layer w0.152: U12.38 33.54,36.59 v1(33.28,36.85) ; CN3.3 52.95,19.19 52.82,19.31 D9.7 50.54,19.31 48.01,21.84 48.01,24.13 42.16,29.97 v1(40.39,29.97)
  Bottom Layer w0.152: v1(40.39,29.97) 38.35,29.97 35.31,33.02 35.31,35.18 33.64,36.85 v1(33.28,36.85)
CONSOLE_TXD: length 33
  Top Layer w0.152: v1(40.39,28.7) 42.54,28.7 47.5,23.75 47.5,21.59 50.28,18.81 D9.6 52.82,18.81 53.72,17.91 54.81,17.91 CN3.2 ; U12.37 33.4,36.19 v1(33.27,36.06)
  Bottom Layer w0.152: v1(33.27,36.06) 33.4,36.06 34.54,34.92 34.54,32.77 38.61,28.7 v1(40.39,28.7)
DISP_CS: length 32.1
  Top Layer w0.152: v1(31.24,40.51) 31.48,40.75 U12.54 ; FPC1.7 30.23,67.92 v1(29.51,68.65)
  Bottom Layer w0.152: v1(29.51,68.65) 30.86,67.3 30.86,40.89 v1(31.24,40.51)
DISP_DC: length 31.2
  Top Layer w0.152: U12.48 v1(34.61,41.66) ; FPC1.5 31.23,68.55 v1(31.14,68.65)
  Bottom Layer w0.152: v1(34.61,41.66) 34.61,65.17 v1(31.14,68.65)
DISP_RST: length 32
  Top Layer w0.152: v1(32.13,40.51) 31.88,40.76 U12.53 ; FPC1.6 30.73,68.24 v1(30.32,68.65)
  Bottom Layer w0.152: v1(30.32,68.65) 32.13,66.84 v1(32.13,40.51)
FLASH_CS: length 39.7
  Top Layer w0.152: U6.1 45.72,68.07 47.04,69.39 R9.2
  Top Layer w0.28: U6.1 45.72,65.03 46.86,63.88 46.86,56.26 44.7,54.1 44.7,42.42 40.08,37.79 RN3.8
HS_DM: length 19.8
  Top Layer w0.229: 35.45,34.96 35.43,34.98 34.88,34.98 34.86,34.99 U12.34
  Top Layer w0.254: USBC1.A7 52.2,34.94 52.18,34.96 51.44,34.96 ; 51.44,34.96 51.44,33.94 USBC1.B7 ; 51.44,34.96 35.45,34.96
HS_DP: length 20.7
  Top Layer w0.229: U12.35 34.86,35.39 34.88,35.41 35.43,35.41 35.45,35.42
  Top Layer w0.254: USBC1.A6 53.34,34.44 53.34,35.43 53.33,35.44 USBC1.B6 52.2,35.44 52.18,35.42 35.45,35.42
HS_R: length 2.2
  Top Layer w0.152: U12.33 35.49,34.59 35.54,34.54 36.5,34.54 36.7,34.34
HS_VBUS: length 17.5
  Top Layer w0.203: 52.39,37.24 USBC1.B4 ; USBC1.B9 USBC1.A4
  Top Layer w0.254: USBC1.B4 53.17,36.94 53.85,36.27 53.85,33.12 53.17,32.44 USBC1.B9 ; 52.39,37.24 49.88,37.24 48.15,38.97 D5.1 48.15,43.91 U11.1
I2C1_SCL: length 45.5
  Top Layer w0.152: U12.58 29.88,42.76 29.68,42.96 RN1.8 RN1.1 29.68,44.87 29.59,44.96 29.59,46.48 26.16,49.91 22.73,49.91 v1(22.22,50.42) 22.22,53.03 21.02,54.24 U9.1 21.02,56.02 R15.2 20.78,58.46 U5.8 ; v1(11.43,47.37) 11.43,43.43 10.15,42.16 D4.9 D4.2 7.46,42.16 7.32,42.3 CN2.4
  Bottom Layer w0.152: v1(11.43,47.37) 13.34,47.37 14.35,48.39 20.19,48.39 v1(22.22,50.42)
I2C1_SDA: length 47
  Top Layer w0.152: v1(18.14,50.42) 18.14,53.27 19.12,54.24 U9.3 19.12,55.95 19.43,56.26 19.43,58.53 ; v1(18.14,50.42) 18.14,50.42 R17.2 ; v1(18.14,50.42) 18.14,49.93 18.67,49.4 26.03,49.4 29.21,46.23 29.21,42.8 29.48,42.53 U12.59 ; v1(10.41,49.28) 10.41,43.43 9.64,42.66 D4.10 D4.1 7.46,42.66 6.57,43.55 CN2.3
  Bottom Layer w0.152: v1(18.14,50.42) 14.35,50.42 13.21,49.28 v1(10.41,49.28)
I2C3_SCL: length 27.7
  Top Layer w0.152: U12.8 27.38,37.79 v1(27.69,38.1) ; CN2.6 6.61,39.8 7.46,40.66 D4.5 D4.6 10.02,40.66 10.41,40.26 v1(10.41,39.12) R20.2
  Bottom Layer w0.152: v1(10.41,39.12) 18.05,39.12 18.11,39.05 21.77,39.05 21.84,39.12 26.67,39.12 v1(27.69,38.1)
I2C3_SDA: length 30.2
  Top Layer w0.152: R21.2 v1(11.43,37.46) 11.43,40.26 10.53,41.16 D4.7 D4.4 7.46,41.16 7.36,41.05 CN2.5
  Top Layer w0.203: v1(28.57,37.72) 28.25,37.39 U12.9
  Bottom Layer w0.152: v1(11.43,37.46) 28.32,37.46 v1(28.57,37.72)
IREF: length 2.2
  Top Layer w0.152: FPC1.8 29.73,65.21 R14.2
IRQ_I2C: length 35.8
  Top Layer w0.152: U12.2 23.18,40.19 22.73,40.64 22.73,42.76 23.5,43.52 v1(23.5,46.57) ; R11.1 16.52,66.25 v1(17.27,66.25) 17.27,65.4 18.16,64.52 U5.3
  Bottom Layer w0.152: v1(17.27,66.25) 17.27,65.02 23.5,58.8 v1(23.5,46.57)
IRQ_NEXT: length 18.8
  Top Layer w0.152: U12.30 32.68,32.22 35.31,29.59 v1(35.56,29.59) ; U14.12 v1(29.97,20.04)
  Bottom Layer w0.152: v1(35.56,29.59) 29.72,23.75 29.72,20.29 v1(29.97,20.04)
IRQ_PREV: length 17.9
  Top Layer w0.152: v1(36.83,27.05) 36.58,27.05 31.88,31.75 U12.28 ; U14.8 v1(35.05,20.04)
  Bottom Layer w0.152: v1(36.83,27.05) 35.05,25.27 v1(35.05,20.04)
IRQ_SELECT: length 18.2
  Top Layer w0.152: U12.29 32.28,31.98 35.94,28.32 v1(36.19,28.32) ; U14.10 v1(32.51,20.04)
  Bottom Layer w0.152: v1(36.19,28.32) 32.51,24.64 v1(32.51,20.04)
LED0: length 36.9
  Top Layer w0.152: R38.1 v1(5.46,13.51)
  Top Layer w0.203: v1(28.57,36.7) 28.29,36.99 U12.10
  Bottom Layer w0.152: 5.46,13.51 5.46,14.99 27.43,36.96 28.32,36.96 v1(28.57,36.7)
OSC32_IN: length 10.5
  Top Layer w0.152: 22.01,45.72 22.01,45.25 21.06,44.3 X1.1 21.06,41.68 22.95,39.79 U12.3
OSC32_OUT: length 12.5
  Top Layer w0.152: 17.62,45.72 17.62,45.25 18.56,44.3 X1.2 18.56,42.78 19.56,41.78 20.32,41.78 22.71,39.39 U12.4
OSC_IN: length 8.4
  Top Layer w0.152: U12.5 21.08,38.99 X2.3 19.94,39.03 19.94,40.04 19.59,40.39
OSC_OUT: length 12
  Top Layer w0.152: U12.6 24.62,38.59 21.59,35.56 19.61,35.56 18.43,36.74 X2.1 18.03,37.05 16.26,37.05
PA0: length 6.5
  Top Layer w0.152: U12.14 25.23,35.39 24.64,34.8 24.64,31.16 RN4.1
PA1: length 6.1
  Top Layer w0.152: U12.15 25.47,34.99 25.15,34.67 25.15,30.96 RN4.2
PA4: length 2.8
  Top Layer w0.152: RN5.1 28.68,32.41 U12.20
PA5: length 3.2
  Top Layer w0.152: U12.21 29.08,32.1 RN5.2
PA6: length 3.5
  Top Layer w0.152: 28.16,30.48 29.48,31.79 U12.22
PA7: length 3.9
  Top Layer w0.152: U12.23 29.88,31.49 28.52,30.12
PB1: length 11.1
  Top Layer w0.152: U12.27 31.48,31.43 36.62,26.29 TP1.1
QSPI1_CS: length 12.4
  Top Layer w0.33: 33.94,45.54 34.29,45.89 34.29,46.23 37.62,49.56 arc(37.79,49.81) 37.85,50.1 37.85,53.53 arc(37.79,53.82) 37.62,54.07 37.56,54.13 arc(37.31,54.3) 37.02,54.36 U8.1
QSPI1_IO0: length 18
  Top Layer w0.33: U8.5 27.37,58.17 arc(27.08,58.11) 26.83,57.94 25.12,56.23 arc(24.95,55.98) 24.89,55.69 24.89,52.77 arc(24.95,52.48) 25.12,52.23 29.8,47.54 arc(29.97,47.29) 30.02,47 30.02,45.03 30.18,44.87 RN1.2
QSPI1_IO1: length 14.5
  Top Layer w0.33: U8.2 37.02,55.63 arc(37.31,55.57) 37.56,55.4 38.38,54.58 arc(38.55,54.33) 38.61,54.04 38.61,49.82 arc(38.55,49.53) 38.38,49.28 RN2.6
QSPI1_IO2: length 16.7
  Top Layer w0.33: U8.3 37.02,56.9 arc(37.31,56.84) 37.56,56.67 39.15,55.09 arc(39.31,54.84) 39.37,54.55 39.37,49.59 arc(39.31,49.3) 39.15,49.05 35.31,45.21 35.02,45.21 RN2.7
QSPI1_IO3: length 14.8
  Top Layer w0.33: RN1.4 31.18,44.9 31.37,45.08 31.37,47.69 arc(31.31,47.98) 31.15,48.23 26.64,52.74 arc(26.47,52.98) 26.42,53.27 26.42,54.68 arc(26.47,54.97) 26.64,55.21 26.83,55.4 arc(27.08,55.57) 27.37,55.63 U8.7
QSPI1_SCK: length 16.4
  Top Layer w0.33: RN1.3 30.68,47.36 arc(30.62,47.65) 30.46,47.9 25.88,52.48 arc(25.71,52.73) 25.65,53.02 25.65,55.18 arc(25.71,55.47) 25.88,55.72 26.83,56.67 arc(27.08,56.84) 27.37,56.9 U8.6
QSPI_CS: length 3.6
  Top Layer w0.203: RN2.4 32.5,44.1 arc(32.34,43.86) 32.28,43.57 U12.52
QSPI_IO0: length 2
  Top Layer w0.203: U12.57 30.28,42.95 30.18,43.05 RN1.7
QSPI_IO1: length 3.2
  Top Layer w0.203: RN2.3 32.9,43.8 arc(32.74,43.55) 32.68,43.26 U12.51
QSPI_IO2: length 2.9
  Top Layer w0.203: RN2.2 33.3,43.49 arc(33.14,43.24) 33.08,42.95 U12.50
QSPI_IO3: length 2
  Top Layer w0.203: RN1.5 31.18,43.05 31.08,42.95 U12.55
QSPI_SCK: length 1.9
  Top Layer w0.203: RN1.6 30.68,41.72
RST: length 32.5
  Top Layer w0.152: U12.7 24.73,38.19 21.39,34.85 20.96,34.85 ; 20.96,34.85 14.28,34.85 9.4,29.97 9.4,25.91 7.06,23.57 D8.2 5.57,23.54 SW2.4 ; 20.96,34.85 20.96,34.2
RTC: length 3.7
  Top Layer w0.152: 21.08,66.11 20.7,65.73 v1(20.7,65.3) U5.1
  Bottom Layer w0.152: v1(20.7,65.3) TP7.1
SD_CS: length 49.3
  Top Layer w0.28: 40.51,84.87 40.51,82.63 40.02,82.14 40.02,78.12 39,77.1 D2.1 39,71.44 R6.1 38.94,70.42 40.13,69.23 40.13,58.55 41.28,57.4 41.28,41.66 38.91,39.29 RN3.5
SD_DETECT: length 58
  Top Layer w0.152: 48.21,84.87 48.21,82.88 47.24,81.91 47.24,80.1 45.81,78.67 D3.6 45.81,76.74 47.04,75.51 R3.1 47.04,72.98 47.62,72.4 47.62,56.22 45.21,53.8 45.21,42.16 40.44,37.39 U12.40
SD_ON: length 60.4
  Top Layer w0.152: 47.87,78.16 47.87,72.91 48.13,72.64 48.13,56.01 45.72,53.59 45.72,41.91 40.8,36.99 U12.39 ; 47.87,78.16 R2.2 ; 47.87,78.16 47.88,78.16 47.88,81.46 52.01,85.59 U2.3
SERIAL_RXD: length 5
  Top Layer w0.152: U12.17 27.48,31.88 RN4.4
SERIAL_TXD: length 5.4
  Top Layer w0.152: U12.16 26.35,31.46 RN4.3
SPI2_CLK: length 83.5
  Top Layer w0.254: 43.81,81.61 43.81,82.72
  Top Layer w0.28: RN3.7 39.69,38.29 42.79,41.39 42.79,57.8 43.18,58.18 U6.6 ; FPC1.4 31.73,71.23 33.27,72.77 36.19,72.77 36.83,73.41 36.83,86.61 38.23,88.01 42.42,88.01 43.81,86.61 43.81,85.83 43.81,85.82 43.81,84.87
  Top Layer w0.33: 43.81,82.72 43.81,84.87 ; 43.81,81.61 D3.10 43.81,65.15 43.18,64.51 U6.6
SPI2_MISO: length 49.3
  Top Layer w0.229: 38.6,39.83 36.14,39.83 35.71,39.39 U12.45
  Top Layer w0.28: v1(43.81,45.08) 43.81,61.09 45.09,62.36 45.09,68.49 45.39,68.79 R13.1 45.39,69.89 45.29,69.99 R8.1 45.31,75.46 45.31,80.24 46.23,81.15 R1.1 ; 38.6,39.83 v1(40.47,41.7)
  Bottom Layer w0.28: v1(43.81,45.08) 43.81,45.04 v1(40.47,41.7)
SPI2_MOSI: length 78.5
  Top Layer w0.28: RN3.6 39.3,38.79 41.91,41.4 U6.5 41.91,64.43 40.97,65.36 R7.1 41,73.44 D2.5 41,81.9 41.61,82.5 41.61,86.28 40.89,86.99 38.61,86.99 37.85,86.23 37.85,72.9 36.7,71.75 33.66,71.75 32.59,70.69 32.59,68.43 32.23,68.07 FPC1.3
SW_NEXT: length 6.7
  Top Layer w0.152: U14.1 27.43,10.74 R42.1 27.49,10.65 D13.2 27.49,6.35 SW3.2
SW_PREV: length 7.1
  Top Layer w0.152: U14.5 32.51,10.74 R44.1 32.57,10.65 D15.2 32.57,8.33 33.48,7.41 SW3.1
SW_SELECT: length 6.9
  Top Layer w0.152: U14.3 29.97,10.74 R43.1 30.05,9.04 D14.2 30.03,8.18 29.48,7.64 SW3.T
SYS_SWCLK: length 34.3
  Top Layer w0.152: v1(40.39,32.51) 41.4,32.51 49.02,24.89 49.02,22.35 50.56,20.81 D9.10 52.82,20.81 53.69,21.69 CN3.5 ; v1(33.4,40.51) 33.48,40.59 U12.49
  Bottom Layer w0.152: v1(40.39,32.51) 39.24,32.51 37.85,33.91 37.85,36.58 33.91,40.51 v1(33.4,40.51)
SYS_SWDIO: length 33.7
  Top Layer w0.152: U12.46 33.57,39.79 v1(33.4,39.62) ; CN3.4 52.95,20.44 52.82,20.31 D9.9 50.3,20.31 48.51,22.1 48.51,24.49 41.76,31.24 v1(40.39,31.24)
  Bottom Layer w0.152: v1(40.39,31.24) 39.5,31.24 37.08,33.65 37.08,36.32 33.78,39.62 v1(33.4,39.62)
T_AUX_RXD: length 5.5
  Top Layer w0.152: RN8.7 43.95,9.66 43.7,9.41 D17.7 43.7,7.12 43.57,6.99 CN5.3
T_AUX_TXD: length 5.8
  Top Layer w0.152: CN5.2 42.32,6.25 43.2,7.13 D17.6 43.2,9.54 43.45,9.79 RN8.8
T_OE: length 61.2
  Top Layer w0.152: U12.18 27.88,34.6 v1(27.69,34.8) ; 14.74,14.28 14.74,12.2 v1(14.73,12.19) ; 41.67,14.28 41.67,12.46 v1(41.4,12.19) R45.1
  Bottom Layer w0.152: v1(41.4,12.19) 37.08,12.19 36.05,11.16 ; v1(14.73,12.19) 15.88,12.19 16.45,12.76 18.35,12.76 ; 36.05,11.16 36.07,11.16 ; 36.05,11.16 27.79,11.16 27.69,11.05 27.69,11.03 26.95,10.29 24.13,10.29 21.65,12.76 18.35,12.76 ; 18.35,12.76 18.35,16.57 27.69,25.91 v1(27.69,34.8)
T_POWER_ON: length 28.9
  Top Layer w0.152: v1(25.84,11.42) U16.3 25.07,11.41 R41.2 ; U12.19 28.28,34.5 v1(28.57,34.8)
  Bottom Layer w0.152: v1(25.84,11.42) 28.57,14.16 v1(28.57,34.8)
T_RST: length 12.7
  Top Layer w0.152: 45.2,9.54 44.95,9.79 RN8.5 ; 45.2,9.54 D17.10 45.2,7.13 46.07,6.25 CN5.5 ; 45.2,9.54 47.14,9.54 48.09,10.49 R46.2 49.86,10.49 50.31,10.94 Q1.3
T_RST_IN: length 17
  Top Layer w0.152: U12.26 31.08,31.12 36.8,25.4 42.08,25.4 RN6.8
T_RST_OUT: length 4.3
  Top Layer w0.152: 36.65,30.66 33.85,33.46 U12.32
T_RXD: length 5.5
  Top Layer w0.152: RN7.7 16.51,9.64 16.26,9.39 D12.7 16.26,7.12 16.14,6.99 CN4.3
T_SWCLK: length 5.8
  Top Layer w0.152: RN7.5 17.51,9.66 17.76,9.41 D12.10 17.76,7.25 18.64,6.38 CN4.5
T_SWDIO: length 5.5
  Top Layer w0.152: RN7.6 17.01,9.66 17.26,9.41 D12.9 17.26,7.12 17.39,7 CN4.4
T_SWO: length 5.5
  Top Layer w0.152: RN8.6 44.45,9.66 44.7,9.41 D17.9 44.7,7.11 44.82,6.99 CN5.4
T_TXD: length 5.8
  Top Layer w0.152: CN4.2 14.89,6.38 15.76,7.25 D12.6 15.76,9.41 16.01,9.66 RN7.8
VCOMH: length 5.3
  Top Layer w0.152: C14.2 27.57,62.23 28.73,63.39 FPC1.10
VIO: length 90.4
  Top Layer w0.152: CN5.1 v1(41.07,9.25) 41.09,9.23 D16.2 ; 13.05,9.32 13.05,13.62 12.27,14.4 R33.2 R32.2 12.27,18.56 12.16,18.67 ; 13.05,9.32 12.52,9.32 11.94,9.91 R40.2 ; 13.05,9.32 v1(13.63,9.32) ; 23.37,18.71 23.33,18.67 R28.2 R34.2 21.77,16.72 21.43,16.38 19.43,16.38 18.64,15.59 18.64,12.98 19.3,12.32 19.3,11.47 v1(20.19,11.47) 23.14,11.47 U16.1 ; 39.08,18.67 39.19,18.56 39.19,17.91 ; 39.19,17.91 43.05,17.91 45.57,15.39 45.57,13.27 v1(46.48,12.36) 46.48,11.47 47.37,11.47 47.48,11.35 R46.1 ; 39.19,17.91 R36.2 R35.2
  Top Layer w0.203: v1(13.63,9.32) D11.2 13.64,8.43 CN4.1
  Bottom Layer w0.254: v1(46.48,12.36) 43.38,9.25 v1(41.07,9.25) 37.82,9.25 36.83,8.25 TP10.1 24.51,8.25 21.3,11.47 v1(20.19,11.47) 17.05,11.47 14.9,9.32 v1(13.63,9.32)
VSD: length 20
  Top Layer w0.254: 42.04,79.67 42.04,80.39 43.11,81.46 C4.2 43.11,83.25 42.71,83.65 v1(42.71,86.27) ; U2.1 v1(53.91,87.13)
  Bottom Layer w0.254: v1(42.71,86.27) 43.57,87.13 v1(53.91,87.13)
$1N200169: length 2.4
  Top Layer w0.229: U12.44 35.94,38.99 36.24,39.29 RN3.4
$1N200184: length 6.4
  Top Layer w0.152: U12.62 28.28,45.89 27.18,46.99 R19.1
$1N200200: length 2.4
  Top Layer w0.229: RN3.3 36.38,38.79 36.18,38.59 U12.43
$1N200201: length 2.3
  Top Layer w0.229: RN3.2 36.51,38.29 36.41,38.19 U12.42
$1N200203: length 2.3
  Top Layer w0.229: U12.41 RN3.1
$1N206167: length 3.1
  Top Layer w0.152: LED1.1 1.74,12.65 R38.2
$1N254528: length 3.3
  Top Layer w0.152: USBC1.B5 52.38,36.45 R22.1
$1N254529: length 3.3
  Top Layer w0.152: USBC1.A5 49.09,33.44 R25.2
$1N254540: length 5.6
  Top Layer w0.152: R27.2 49.2,30.34 49.19,30.35 53.14,30.35 USBC1.0
$2N508660: length 2.4
  Top Layer w0.28: R1.2 46.23,83.57 46.01,83.78 46.01,84.87
$2N741099: length 2.7
  Top Layer w0.28: U6.2 44.44,69.26 R13.2
$2N788708: length 4.1
  Top Layer w0.152: 28.61,22.48 28.61,21.68 28.88,21.41 R29.2 28.88,20.12 28.7,19.94 U14.13
$2N788718: length 8.1
  Top Layer w0.152: R29.1 28.07,20.78 28.07,16 28.7,15.37 U14.2
$2N788818: length 4.1
  Top Layer w0.152: 31.53,22.48 31.42,22.37 R30.2 31.42,20.12 31.24,19.94 U14.11
$2N788825: length 8.1
  Top Layer w0.152: U14.4 31.24,15.37 30.61,16 30.61,20.78 R30.1
$2N788929: length 8.1
  Top Layer w0.152: U14.6 33.78,15.37 33.15,16 33.15,20.78 R31.1
$2N788938: length 4.2
  Top Layer w0.152: U14.9 33.78,19.94 33.96,20.12 R31.2 33.96,21.39 34.45,21.88 34.45,22.48
$3N4347: length 8.7
  Top Layer w0.152: R32.1 15.37,17.14 16.69,15.82 16.69,11.99 16.51,11.81 RN7.2
$3N4348: length 7.6
  Top Layer w0.152: R33.1 13.51,16 15.75,16 16.04,15.71 16.04,11.97 16.01,11.94 RN7.1
$3N4349: length 9.4
  Top Layer w0.152: RN7.3 17.01,11.81 17.34,12.14 17.34,15.95 20.07,18.67 R28.1
$3N4350: length 8.1
  Top Layer w0.152: RN7.4 17.51,11.8 17.99,12.28 17.99,15.83 19.3,17.14 R34.1
$3N4403: length 13.1
  Top Layer w0.152: U13.1 19.29,20.9 RN5.5
$3N4404: length 13.6
  Top Layer w0.152: U13.2 18.64,20.96 RN5.6
$3N4405: length 14
  Top Layer w0.152: U13.3 17.99,21.01 27.21,30.23
$3N4406: length 14.5
  Top Layer w0.152: 26.85,30.58 17.34,21.07 U13.4
$3N4411: length 12.1
  Top Layer w0.152: U13.5 16.69,21.09 24.49,28.89
$3N4412: length 12.6
  Top Layer w0.152: U13.6 16.04,21.15 24.13,29.24
$3N4413: length 13.1
  Top Layer w0.152: RN4.7 15.39,21.21 U13.7
$3N4414: length 13.5
  Top Layer w0.152: RN4.8 14.74,21.26 U13.8
$3N5227: length 3.1
  Top Layer w0.152: 42.97,14.28 42.97,12.41 43.45,11.93 RN8.1
$3N5228: length 8.1
  Top Layer w0.152: RN8.2 43.95,12.19 43.62,12.52 43.62,15.31 42.93,16 40.87,16 40.49,15.62 R35.1
$3N5229: length 9.2
  Top Layer w0.152: R36.1 42.8,17.14 44.27,15.68 44.27,12.76 44.45,12.58 RN8.3
$3N5230: length 2.9
  Top Layer w0.152: RN8.4 44.95,12.92 44.92,12.95 44.92,14.28
$3N5450: length 25.7
  Top Layer w0.152: Q1.1 52.51,14.8 50.49,16.82 R37.2 49.91,18.41 46.99,21.34 46.99,23.37 42.93,27.43 39.88,27.43 37.26,30.05 37.26,30.17
$3N53774: length 2.6
  Top Layer w0.203: L1.1 15.24,85.16 U3.13
$3N53786: length 2.6
  Top Layer w0.203: U3.12 16.51,85.16 L1.2
$3N86563: length 4.4
  Top Layer w0.152: RN6.1 44.92,22.56 U15.3
$3N86568: length 3.9
  Top Layer w0.152: U15.4 44.27,22.51 RN6.2
$3N86573: length 3.4
  Top Layer w0.152: 42.92,23.14 43.62,22.45 43.62,20.01
$3N86578: length 2.9
  Top Layer w0.152: U15.6 42.97,22.39 42.57,22.79

## Copper pours and planes (outline as drawn; the poured copper is in the pictures)
3.3V on Top Layer: 54.49,70.89 57.53,70.89 57.53,69.21 54.49,69.21
3.3V on Top Layer: 50.18,76.83 50.18,81.79 54.48,81.79 54.48,79.63 52.53,79.63 52.25,79.38 52.25,76.83
3.3V on Top Layer: 19.38,73.74 19.38,68.94 18.57,68.94 18.57,70.7 18.72,70.84 18.72,73.74
3.3V on Inner2: -5.08,106.17 66.04,106.17 66.04,-5.59 -5.08,-5.59
5V on Top Layer: 50.09,72.9 50.09,71.73 53.62,71.73 53.62,74.42 52.55,74.42 52.55,72.9
5V on Top Layer: 11.76,73.74 11.76,67.87 10.96,67.87 10.96,70.69 11.1,70.83 11.1,73.74
5V on Top Layer: 52.83,61.59 54.1,61.59 54.1,55.66 52.83,55.66
5V on Top Layer: 49.34,61.59 54.1,61.59 54.1,55.59 49.34,55.59
12V on Top Layer: 51.69,66.09 51.69,63.52 51.97,63.29 51.97,61.87 54.06,61.87 54.06,62.56 52.93,62.56 52.93,64.2 53.21,64.45 53.21,66.09
GND on Top Layer: 12.37,73.74 12.37,67.51 13.18,67.51 13.18,70.69 13.03,70.84 13.03,73.74
GND on Top Layer: 19.99,73.74 19.99,68.81 20.8,68.81 20.8,70.69 20.65,70.84 20.65,73.74
GND on Top Layer: 53.75,77.11 54.46,77.11 54.46,74.73 53.75,74.73
GND on Top Layer: -7.62,108.71 68.58,108.71 68.58,-8.13 -7.62,-8.13
GND on Top Layer: 54.61,62.51 56.9,62.51 56.9,61.95 54.61,61.95
GND on Bottom Layer: -9.86,112.93 71.43,112.93 71.43,-8.99 -9.86,-8.99
GND on Bottom Layer: -10.16,111.25 71.12,111.25 71.12,-10.67 -10.16,-10.67
GND on Inner1: -2.54,103.63 63.5,103.63 63.5,-3.05 -2.54,-3.05
GND on Inner2: 38.84,41.17 38.77,41.25 38.71,41.39 38.69,41.53 38.71,41.67 38.77,41.8 38.84,41.89 43.51,46.56 43.59,46.63 43.73,46.69 43.87,46.71 44.01,46.69 44.14,46.63 44.23,46.56 45.31,45.48 45.37,45.4 45.43,45.26 45.45,45.12 45.43,44.98 45.37,44.85 45.31,44.76 40.64,40.09 40.55,40.02 40.42,39.96 40.28,39.94 40.13,39.96 40,40.02 39.92,40.09
CAN_5V_IN on Top Layer: 18.11,81.72 18.11,84.78 19,84.78 19,87.55 17.45,87.55 17.45,81.72
CAN_5V_OUT on Top Layer: 11.76,81.72 11.76,88.47 10.21,88.47 10.21,84.96 11.1,84.07 11.1,81.72
CAN_5V_OUT on Top Layer: 19.61,86.69 19.61,88.47 21.16,88.47 21.16,87.43 20.42,86.69
CAN_5V_OUT on Bottom Layer: 10.16,88.39 10.18,88.49 10.23,88.57 10.32,88.63 10.41,88.65 21.08,88.65 21.18,88.63 21.26,88.57 21.32,88.49 21.34,88.39 21.34,87.88 21.32,87.79 21.26,87.7 21.18,87.65 21.08,87.63 10.41,87.63 10.32,87.65 10.23,87.7 10.18,87.79 10.16,87.88
CAN_GND on Top Layer: -2.03,100.71 -2.02,100.89 -1.98,101.17 -1.9,101.44 -1.78,101.7 -1.62,101.93 -1.44,102.15 -1.22,102.33 -0.99,102.49 -0.73,102.61 -0.46,102.69 -0.18,102.74 0,102.74 25.71,102.74 25.88,102.74 26.16,102.69 26.43,102.61 26.69,102.49 26.93,102.33 27.14,102.15 27.33,101.93 27.48,101.7 27.6,101.44 27.68,101.17 27.73,100.89 27.74,100.71 27.74,83.77 27.73,83.59 27.68,83.31 27.6,83.04 27.48,82.78 27.33,82.55 27.14,82.33 26.93,82.15 26.69,81.99 26.43,81.87 26.16,81.79 25.88,81.74 25.71,81.74 0,81.74 -0.18,81.74 -0.46,81.79 -0.73,81.87 -0.99,81.99 -1.22,82.15 -1.44,82.33 -1.62,82.55 -1.78,82.78 -1.9,83.04 -1.98,83.31 -2.02,83.59 -2.03,83.77
CAN_GND on Top Layer: 12.38,81.72 12.38,88.04 13.17,88.04 13.17,84.76 13.03,84.62 13.03,81.72
CAN_GND on Bottom Layer: -2.03,100.71 -2.02,100.89 -1.98,101.17 -1.9,101.44 -1.78,101.7 -1.62,101.93 -1.44,102.15 -1.22,102.33 -0.99,102.49 -0.73,102.61 -0.46,102.69 -0.18,102.74 0,102.74 22.35,102.74 22.53,102.74 22.81,102.69 23.08,102.61 23.34,102.49 23.57,102.33 23.79,102.15 23.97,101.93 24.13,101.7 24.25,101.44 24.33,101.17 24.38,100.89 24.38,100.71 24.38,83.76 24.38,83.58 24.33,83.3 24.25,83.03 24.13,82.77 23.97,82.53 23.79,82.32 23.57,82.13 23.34,81.98 23.08,81.86 22.81,81.78 22.53,81.73 22.35,81.72 0,81.72 -0.18,81.73 -0.46,81.78 -0.73,81.86 -0.99,81.98 -1.22,82.13 -1.44,82.32 -1.62,82.53 -1.78,82.77 -1.9,83.03 -1.98,83.3 -2.02,83.58 -2.03,83.76
CAN_GND on Inner1: -2.03,100.71 -2.02,100.89 -1.98,101.17 -1.9,101.44 -1.78,101.7 -1.62,101.93 -1.44,102.15 -1.22,102.33 -0.99,102.49 -0.73,102.61 -0.46,102.69 -0.18,102.74 0,102.74 22.35,102.74 22.53,102.74 22.81,102.69 23.08,102.61 23.34,102.49 23.57,102.33 23.79,102.15 23.97,101.93 24.13,101.7 24.25,101.44 24.33,101.17 24.38,100.89 24.38,100.71 24.38,83.76 24.38,83.58 24.33,83.3 24.25,83.03 24.13,82.77 23.97,82.53 23.79,82.32 23.57,82.13 23.34,81.98 23.08,81.86 22.81,81.78 22.53,81.73 22.35,81.72 0,81.72 -0.18,81.73 -0.46,81.78 -0.73,81.86 -0.99,81.98 -1.22,82.13 -1.44,82.32 -1.62,82.53 -1.78,82.77 -1.9,83.03 -1.98,83.3 -2.02,83.58 -2.03,83.76
CAN_GND on Inner2: -2.03,100.71 -2.02,100.89 -1.98,101.17 -1.9,101.44 -1.78,101.7 -1.62,101.93 -1.44,102.15 -1.22,102.33 -0.99,102.49 -0.73,102.61 -0.46,102.69 -0.18,102.74 0,102.74 22.35,102.74 22.53,102.74 22.81,102.69 23.08,102.61 23.34,102.49 23.57,102.33 23.79,102.15 23.97,101.93 24.13,101.7 24.25,101.44 24.33,101.17 24.38,100.89 24.38,100.71 24.38,83.76 24.38,83.58 24.33,83.3 24.25,83.03 24.13,82.77 23.97,82.53 23.79,82.32 23.57,82.13 23.34,81.98 23.08,81.86 22.81,81.78 22.53,81.73 22.35,81.72 0,81.72 -0.18,81.73 -0.46,81.78 -0.73,81.86 -0.99,81.98 -1.22,82.13 -1.44,82.32 -1.62,82.53 -1.78,82.77 -1.9,83.03 -1.98,83.3 -2.02,83.58 -2.03,83.76
VFB on Top Layer: 54.56,74.32 57.52,74.32 57.52,71.12 54.56,71.12
VSW on Top Layer: 52.58,79.37 52.58,75.57 53.59,75.57 53.59,77.85 54.48,77.85 54.48,79.37
$2N576115 on Top Layer: 55.13,61.59 56.39,61.59 56.39,55.66 55.13,55.66

## Text on the board
Bottom Silkscreen Layer: V1.0 | ISO / GND | ISO / 5V | 32K / RTC | VIO | JLCJLCJLCJLC | GND | 3.3V | 5V / USB | 12V / OLED | 3.3V / SDCARD | CAN | ISO GND / HIGH / LOW / HIGH / LOW / ISO GND | I2C | BOOT | RESET | ARM | VIO / TXD0 / RXD0 / SWDIO / SWCLK / GND | AUX | SWD | VIO / TXD1 / RXD1 / RXD2 / NRST / GND | SCL3 / SDA3 / SCL1 / SDA1 / 3.3V / GND | 3.3V / TXD / RXD / SWDIO / SWCLK / GND | ARM CAN TOOL
Document Layer: NO SOLDER PASTE ON MIDDLE PAD OF BATTERY HOLDER
Top Silkscreen Layer: PB1 | SWD | BATTERY / CR1220 | CANBUS | I2C | BOOT | RESET | ARM | AUX
